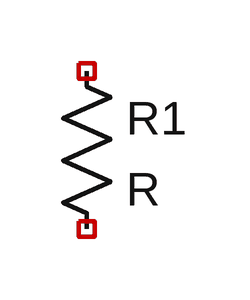
[diagram p0: schematic Voltage_Divider_Step_Response.asc]
Voltage_Divider_Step_Response.asc, the LTspice schematic file:
Version 4
SHEET 1 880 680
SYMBOL res 112 64 R0
SYMATTR InstName R1

The netlist it stands for:
* Voltage_Divider_Step_Response.asc
R1 NC_01 NC_02 R
.backanno
.end